# EasyEDA schematic schematic.json
TITLE: Heart; REV: 1.0; Date: 2024-08-07; Sheet: 1/1; Drawn By: anirudh_sahu_12; Company: Anirudh
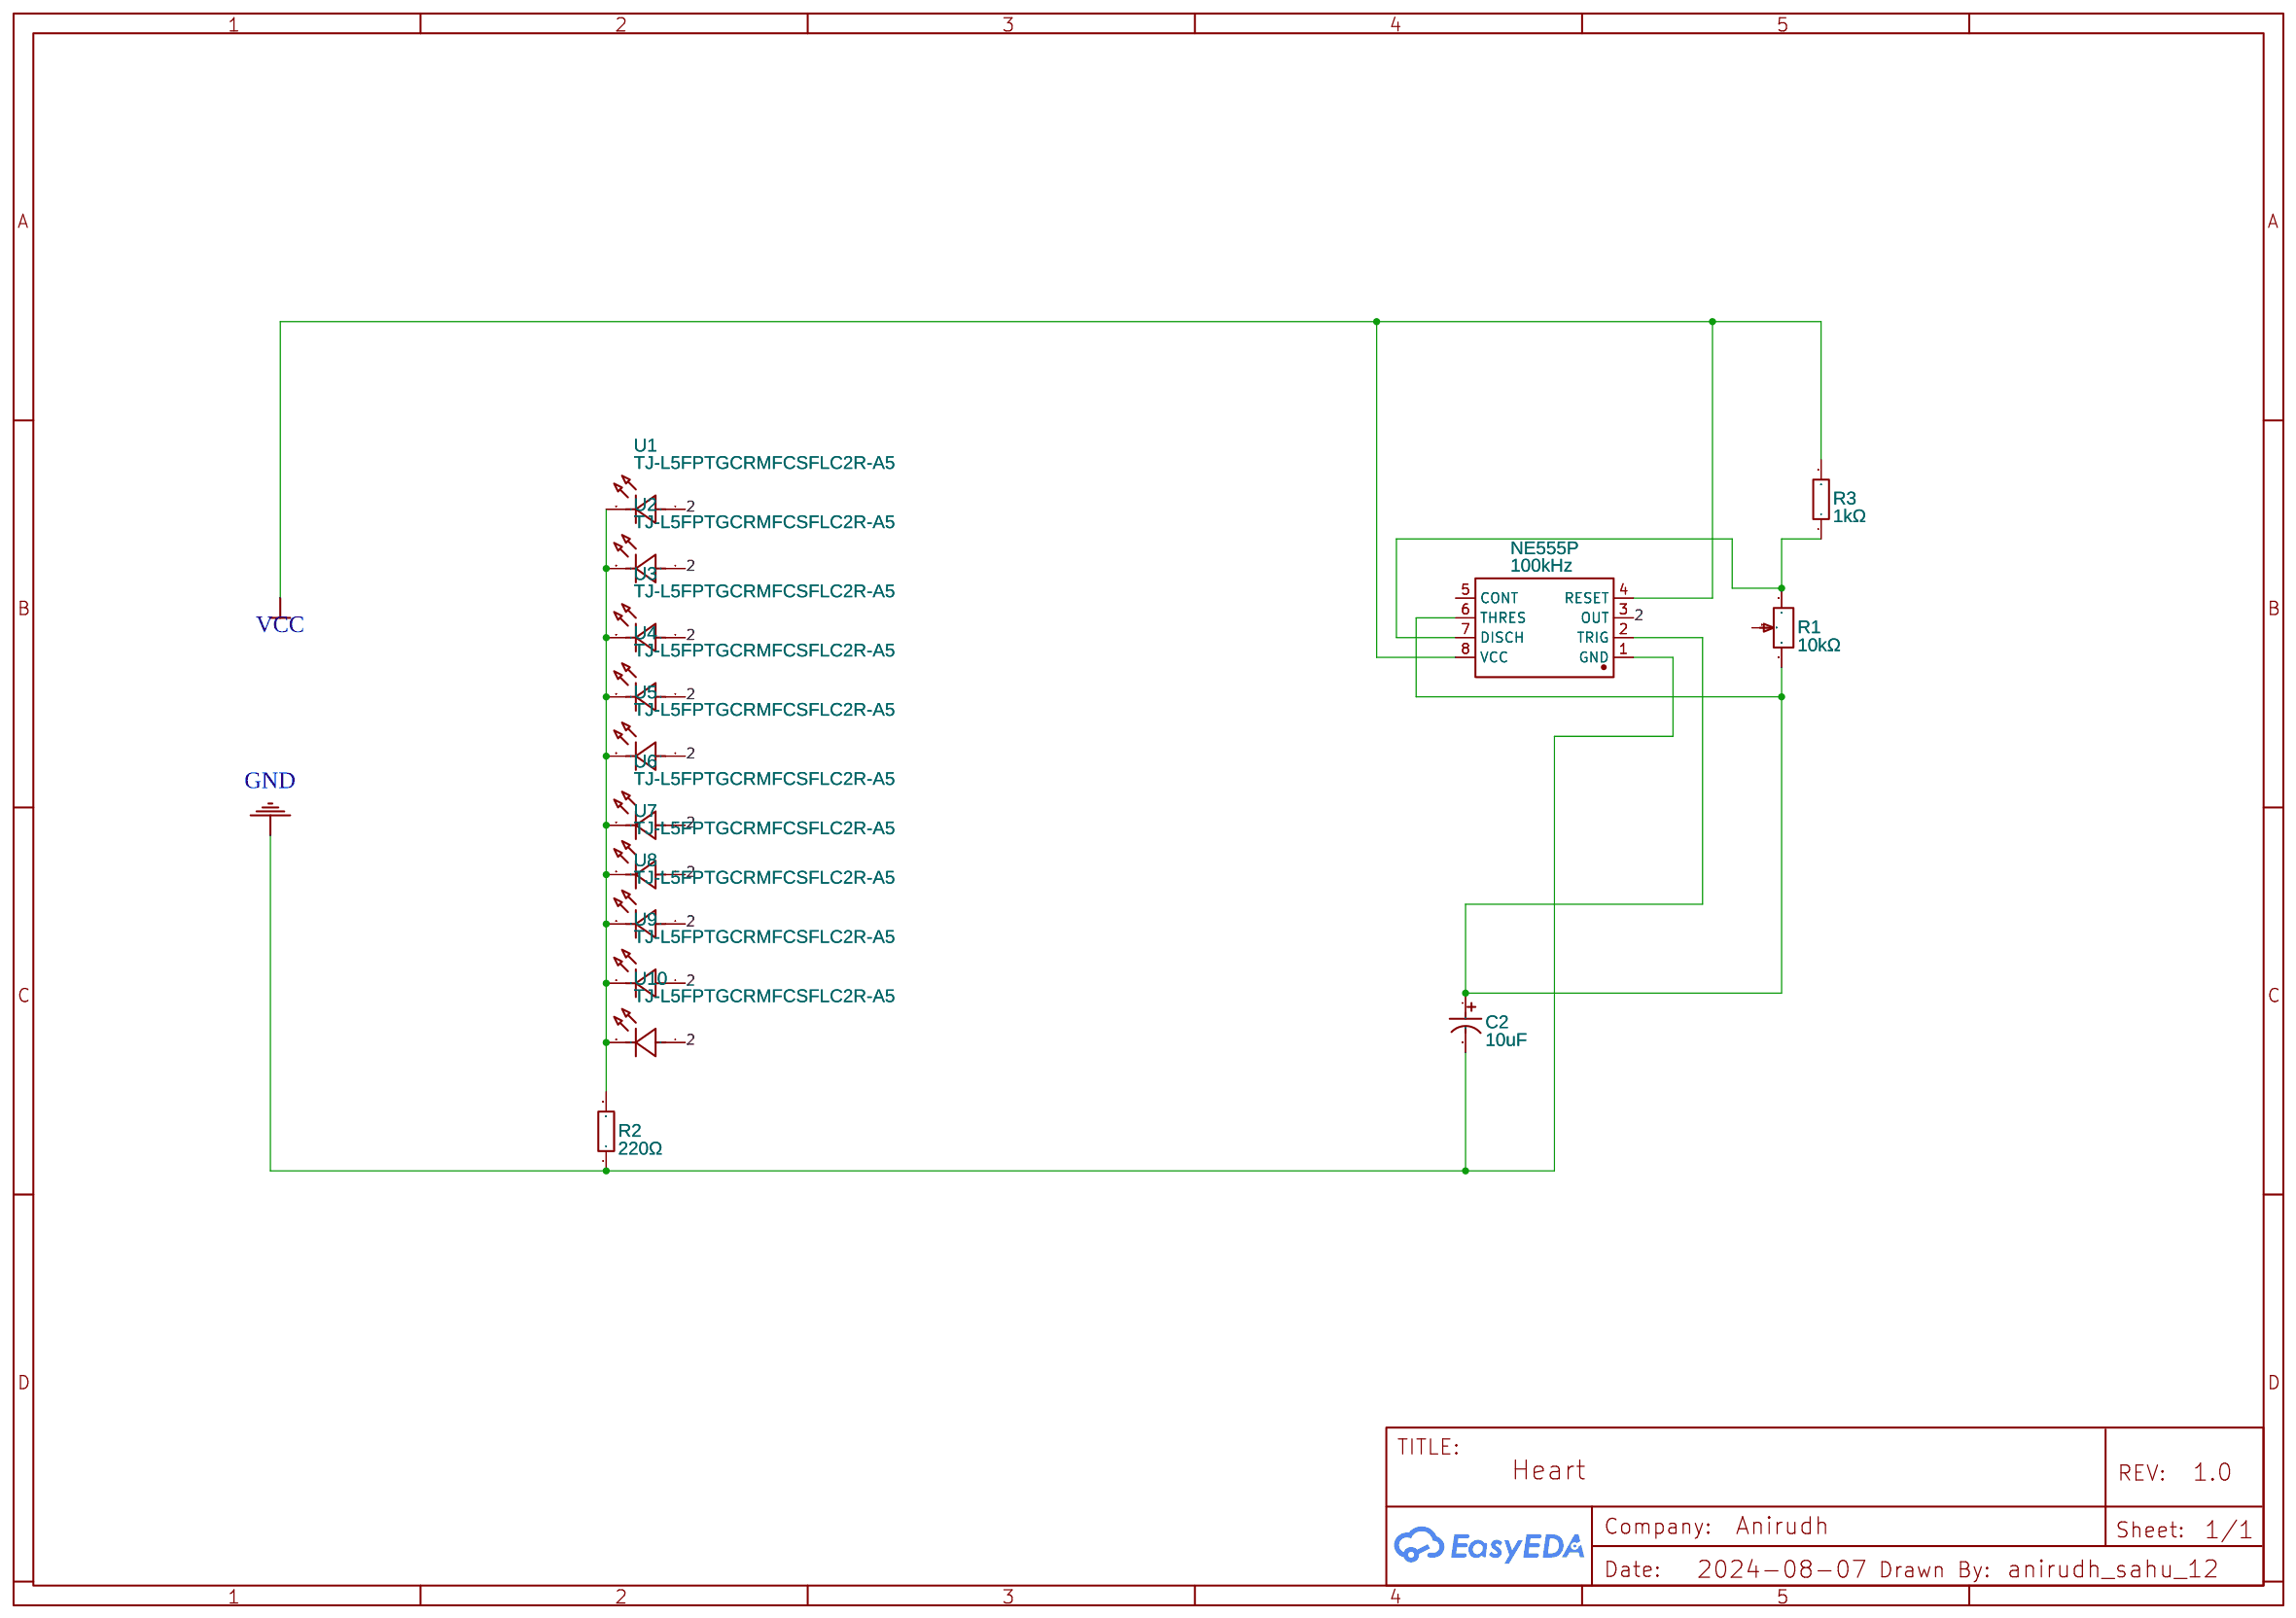
[diagram p0: schematic sheet]

## Parts
C2  10uF  [CAP-SMD_BD6.3-L6.6-W6.6-FD]
NE555P  100kHz  [DIP-8_L9.8-W6.6-P2.54-LS7.6-BL]
R1  10kΩ  [RES-ADJ-TH_3296W]
R2  220Ω  [RES-TH_BD5.0-L15.5-P19.50-D0.7]
R3  1kΩ  [RES-TH_BD4.5-L11.5-P15.50-D0.7]
U1  TJ-L5FPTGCRMFCSFLC2R-A5  [LED-TH_BD5.8-P2.54-FD]
U2  TJ-L5FPTGCRMFCSFLC2R-A5  [LED-TH_BD5.8-P2.54-FD]
U3  TJ-L5FPTGCRMFCSFLC2R-A5  [LED-TH_BD5.8-P2.54-FD]
U4  TJ-L5FPTGCRMFCSFLC2R-A5  [LED-TH_BD5.8-P2.54-FD]
U5  TJ-L5FPTGCRMFCSFLC2R-A5  [LED-TH_BD5.8-P2.54-FD]
U6  TJ-L5FPTGCRMFCSFLC2R-A5  [LED-TH_BD5.8-P2.54-FD]
U7  TJ-L5FPTGCRMFCSFLC2R-A5  [LED-TH_BD5.8-P2.54-FD]
U8  TJ-L5FPTGCRMFCSFLC2R-A5  [LED-TH_BD5.8-P2.54-FD]
U9  TJ-L5FPTGCRMFCSFLC2R-A5  [LED-TH_BD5.8-P2.54-FD]
U10  TJ-L5FPTGCRMFCSFLC2R-A5  [LED-TH_BD5.8-P2.54-FD]

## Library data of the parts
C2 = RVT1H100M0605: Supplier: LCSC; Manufacturer: ROQANG(容强); Supplier Part: C72488; JLCPCB Part Class: Extended Part
NE555P = NE555P: Supplier: LCSC; Manufacturer: TI(德州仪器); Supplier Part: C46749; JLCPCB Part Class: Extended Part
R1 = 3296W-1-103LF: Resistance(Ohms): 10K; Supplier: LCSC; Manufacturer: BOURNS; Supplier Part: C34846; JLCPCB Part Class: Extended Part
R2 = MFR02SF2200A10: Supplier: LCSC; Manufacturer: UNI-ROYAL(厚声); Supplier Part: C58737; JLCPCB Part Class: Extended Part
R3 = MFR01SF1001A10: Supplier: LCSC; Manufacturer: UNI-ROYAL(厚声); Supplier Part: C58688; JLCPCB Part Class: Extended Part
U1-U10 = TJ-L5FPTGCRMFCSFLC2R-A5: Contributor: lcsc; Supplier: LCSC; Supplier Part: C331030; Manufacturer: TOGIALED(统佳); JLCPCB Part Class: Extended Part

## Nets
GND: C2.2 NE555P.1(GND) R2.1
VCC: NE555P.4(RESET) NE555P.8(VCC) R3.2
2: NE555P.3(OUT) U1.1(A) U2.1(A) U3.1(A) U4.1(A) U5.1(A) U6.1(A) U7.1(A) U8.1(A) U9.1(A) U10.1(A)
Net-(C2-1): C2.1 NE555P.2(TRIG) NE555P.6(THRES) R1.3
Net-(NE555P-7): NE555P.7(DISCH) R1.1 R3.1
Net-(R2-2): R2.2 U1.2(K) U2.2(K) U3.2(K) U4.2(K) U5.2(K) U6.2(K) U7.2(K) U8.2(K) U9.2(K) U10.2(K)

Not connected (* = marked no-connect by the designer): NE555P 5(CONT); R1 2
